# Altium schematic sheet xbowtie2.SchDoc
size A3; SheetNumber: 2; SheetTotal: 3
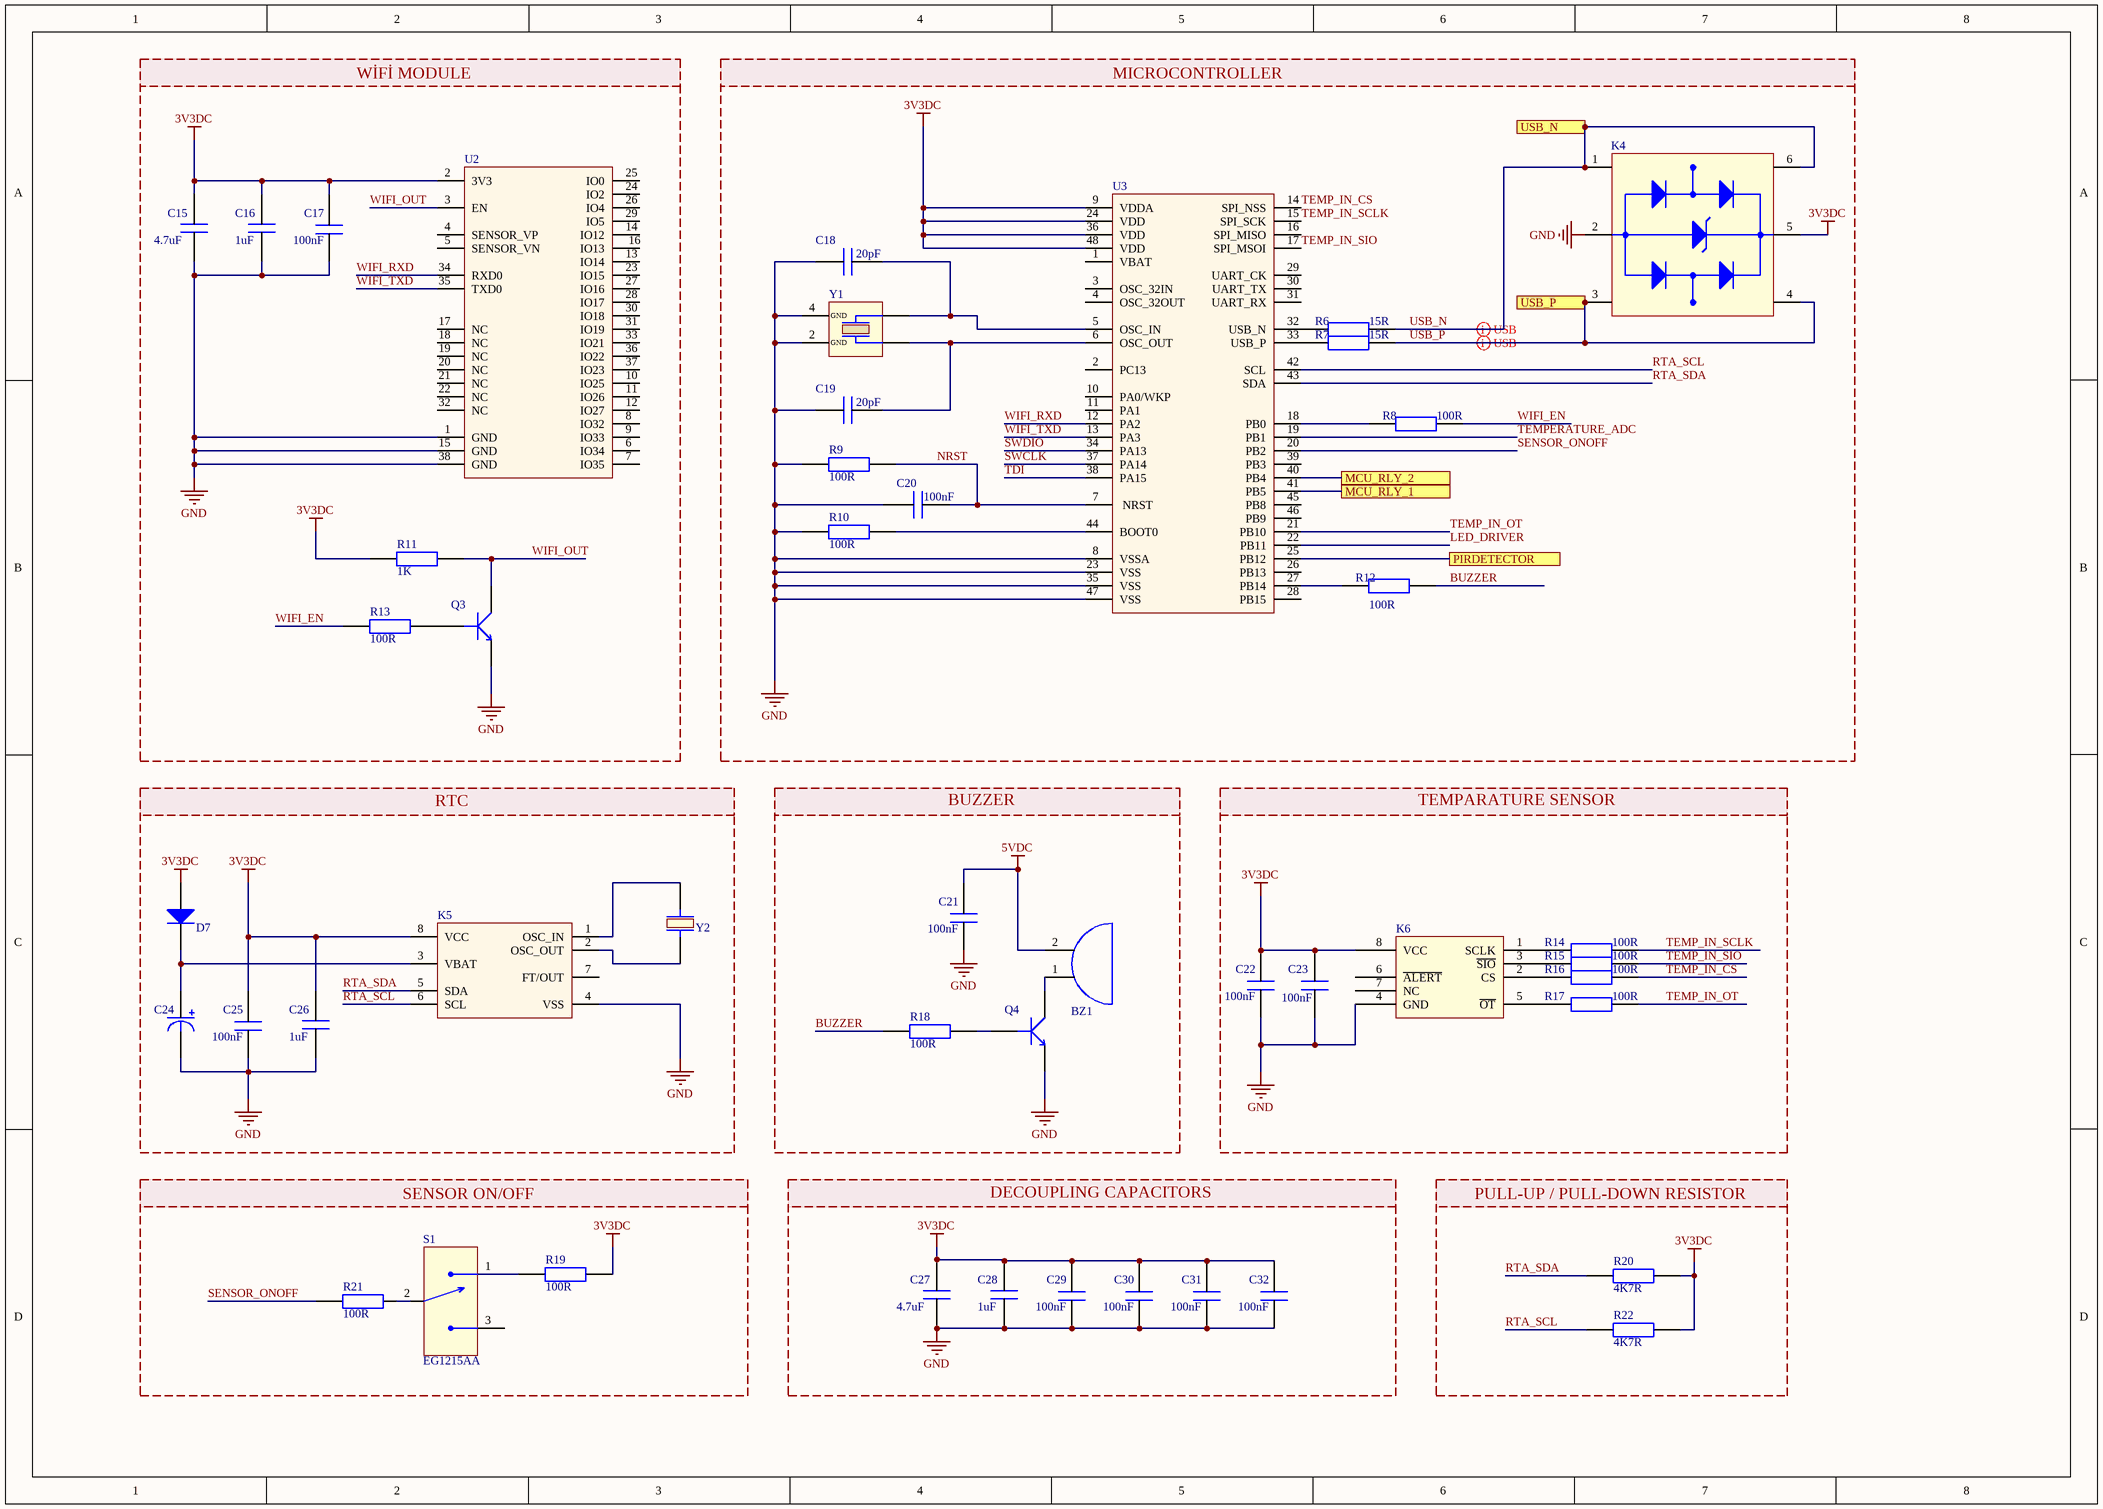
[diagram p0: xbowtie2.SchDoc]

## Parts
BZ1  CMI-9605IC-0580T  [CMI-9605IC]  (value not drawn)
C15  Capacitance: 4.7uF  [CAP_CER 0805]  (hidden comment: CAP CER 4.7uF 0805)
C16  1uF  [CAP_CER 0805]
C17  100nF  [CAP_CER 0805]
C18  20pF
C19  20pF
C20  100nF  [CAP_CER 0805]
C21  100nF  [CAP_CER 0805]
C22  100nF  [CAP_CER 0805]
C23  100nF  [CAP_CER 0805]
C24  ESH477M050AH4AA  [ESH477]  (value not drawn)
C25  100nF  [CAP_CER 0805]
C26  1uF  [CAP_CER 0805]
C27  Capacitance: 4.7uF  [CAP_CER 0805]  (hidden comment: CAP CER 4.7uF 0805)
C28  1uF  [CAP_CER 0805]
C29  100nF  [CAP_CER 0805]
C30  100nF  [CAP_CER 0805]
C31  100nF  [CAP_CER 0805]
C32  100nF  [CAP_CER 0805]
D7  1N4148WS  [1N4148WS]  (value not drawn)
K4  USBLC6-2SC6  [USBLC6-2SC6]  (value not drawn)
K5  M41T00M6F  [M41T00M6F]  (value not drawn)
K6  MAX6662  [MAKSİMUMA 6662MSA+]  (value not drawn)
Q3  MMBT3904-7-F  [MMBT3904-7-F]  (value not drawn)
Q4  MMBT3904-7-F  [MMBT3904-7-F]  (value not drawn)
R6  15R  [RES_0603]
R7  15R  [RES_0603]
R8  100R  [RES_0603]
R9  100R  [RES_0603]
R10  100R  [RES_0603]
R11  1K  [RES_0603]
R12  100R  [RES_0603]
R13  100R  [RES_0603]
R14  100R  [RES_0603]
R15  100R  [RES_0603]
R16  100R  [RES_0603]
R17  100R  [RES_0603]
R18  100R  [RES_0603]
R19  100R  [RES_0603]
R20  4K7R  [RES_0603]
R21  100R  [RES_0603]
R22  4K7R  [RES_0603]
S1  EG1215AA  [EG1215AA]
U2  ESP32-WROOM-32E (4MB)  [ESP32-32E]  (value not drawn)
U3  STM32F103C6T6A  [STM32]  (value not drawn)
Y1  CRYSTAL 16MHz  [ECS]  (value not drawn)
Y2  CRYSTAL 32.7680KHZ 12.5PF SMD  [ABS05]  (value not drawn)

## Ports
MCU_RLY_1, MCU_RLY_2, PIRDETECTOR, USB_N, USB_P

## Nets
3V3DC: C15.2 C16.2 C17.2 C22.2 C23.2 C25.2 C26.2 C27.2 C28.2 C29.2 C30.2 C31.2 C32.2 D7.2 K4.5(VBUS) K5.8(VCC) K6.8(VCC) R11.1 R19.2 R20.2 R22.2 U2.2(3V3) U3.9(VDDA) U3.24(VDD) U3.36(VDD) U3.48(VDD)
5VDC: BZ1.2 C21.2
GND: C15.1 C16.1 C17.1 C18.1 C19.1 C20.2 C21.1 C22.1 C23.1 C24.2 C25.1 C26.1 C27.1 C28.1 C29.1 C30.1 C31.1 C32.1 K4.2(GND) K5.4(VSS) K6.4(GND) Q3.2(E) Q4.2(E) R9.1 R10.1 U2.1(GND) U2.15(GND) U2.38(GND) U3.8(VSSA) U3.23(VSS) U3.35(VSS) U3.47(VSS) Y1.2(GND) Y1.4(GND)
BUZZER: R12.2 R18.1
LED_DRIVER: U3.22(PB11)
MCU_RLY_1: U3.41(PB5) ; port MCU_RLY_1
MCU_RLY_2: U3.40(PB4) ; port MCU_RLY_2
NRST: C20.1 R9.2 U3.7(NRST)
PIRDETECTOR: U3.25(PB12) ; port PIRDETECTOR
RTA_SCL: K5.6(SCL) R22.1 U3.42(SCL)
RTA_SDA: K5.5(SDA) R20.1 U3.43(SDA)
SENSOR_ONOFF: R21.1 U3.20(PB2)
SWCLK: U3.37(PA14)
SWDIO: U3.34(PA13)
TDI: U3.38(PA15)
TEMP_IN_CS: R16.2 U3.14(SPI_NSS)
TEMP_IN_OT: R17.2 U3.21(PB10)
TEMP_IN_SCLK: R14.2 U3.15(SPI_SCK)
TEMP_IN_SIO: R15.2 U3.17(SPI_MSOI)
TEMPERATURE_ADC: U3.19(PB1)
USB_N: K4.1(I/O1_IN) K4.6(I/O1_OUT) R6.2 ; port USB_N
USB_P: K4.3(I/O2_IN) K4.4(I/O2_OUT) R7.2 ; port USB_P
WIFI_EN: R8.2 R13.1
WIFI_OUT: Q3.C R11.2 U2.3(EN)
WIFI_RXD: U2.34(RXD0) U3.12(PA2)
WIFI_TXD: U2.35(TXD0) U3.13(PA3)
NetBZ1_1: BZ1.1 Q4.C
NetC18_2: C18.2 U3.5(OSC_IN) Y1.3
NetC19_2: C19.2 U3.6(OSC_OUT) Y1.1
NetC24_1: C24.1 D7.1 K5.3(VBAT)
NetK5_1: K5.1(OSC_IN) Y2.2
NetK5_2: K5.2(OSC_OUT) Y2.1
NetK6_1: K6.1(SCLK) R14.1
NetK6_2: K6.2(CS) R16.1
NetK6_3: K6.3(~{SIO}) R15.1
NetK6_5: K6.5(~{OT}) R17.1
NetQ3_1: Q3.1(B) R13.2
NetQ4_1: Q4.1(B) R18.2
NetR6_1: R6.1 U3.32(USB_N)
NetR7_1: R7.1 U3.33(USB_P)
NetR8_1: R8.1 U3.18(PB0)
NetR10_2: R10.2 U3.44(BOOT0)
NetR12_1: R12.1 U3.27(PB14)
NetR19_1: R19.1 S1.1
NetR21_2: R21.2 S1.2

Not connected (* = marked no-connect by the designer): K5 7(FT/OUT); K6 6(~{ALERT}) 7(NC); S1 3; U2 4(SENSOR_VP) 5(SENSOR_VN) 6(IO34) 7(IO35) 8(IO32) 9(IO33) 10(IO25) 11(IO26) 12(IO27) 13(IO14) 14(IO12) 17(NC) 18(NC) 19(NC) 20(NC) 21(NC) 22(NC) 23(IO15) 24(IO2) 25(IO0) 26(IO4) 27(IO16) 28(IO17) 29(IO5) 30(IO18) 31(IO19) 32(NC) 33(IO21) 36(IO22) 37(IO23)  16(IO13); U3 1(VBAT) 2(PC13) 3(OSC_32IN) 4(OSC_32OUT) 10(PA0/WKP) 11(PA1) 16(SPI_MISO) 26(PB13) 28(PB15) 29(UART_CK) 30(UART_TX) 31(UART_RX) 39(PB3) 45(PB8) 46(PB9)

## Layout directives
differential pair: USB_N, USB_P

## Notes on the sheet
- WİFİ MODULE
- MICROCONTROLLER
- RTC
- BUZZER
- TEMPARATURE SENSOR
- SENSOR ON/OFF
- DECOUPLING CAPACITORS
- PULL-UP / PULL-DOWN RESISTOR

## Library data of the parts
BZ1 = CMI-9605IC-0580T: Audio Buzzer Magnetic 3VDC 7VDC 30mA 5VDC 85dB 2600Hz to 2800Hz Through Hole Pin Box; Manufacturer: CUI Devices; Shape: 4456Shape; Supplier 1: Digikey; Manufacturer Part Number: CMI-9605IC-0580T; RoHS: No; Category: Audio Products; Stock 1: 5449; Pricing 1: 1=1,22, 10=1,014, 25=0,938, 50=0,883, 100=0,8298, 250=0,76976, 500=0,71396, 1000=0,66741, 5000=0,65403 (USD); Length: 9.6mm; Width: 9.6mm; Height: 5mm; Supplier Part Number 1: 2223-CMI-9605IC-0580T-ND
C15 C27 = CAP CER 4.7uF 0805: Manufacturer: Samsung; Manufacturer Part Number: CL21A475KBQNNNE; Material: 4241ConductorMaterial; Tolerance: 10%; Voltage Rating: 50V; Dielectric: X5R; Supplier 1: Digikey; RoHS: Yes; Category: Ceramic Capacitors; Stock 1: 277343; Pricing 1: 1=0,23, 10=0,148, 50=0,104, 100=0,084, 500=0,06244, 1000=0,05464 (USD); Mount: Surface Mount; Case/Package: 0805; Case Code (Metric): 2012; Case Code (Imperial): 0805; Min Operating Temperature: -55°C; Max Operating Temperature: 85°C; Packaging: Tape and Reel; Series: CL; Voltage Rating (DC): 50V; Package Quantity: 1; Length: 2mm; Width: 0.049inch; Thickness: 0.055inch; Depth: 1.25mm; Radiation Hardening: No; RoHS Compliant: Yes; ComponentLink1URL: https://datasheet.ciiva.com/25797/cl21a475kbqnnne-25797730.pdf?src-supplier=Digikey; ComponentLink1Description: https://datasheet.ciiva.com/25797/cl21a475kbqnnne-25797730.pdf?src-supplier=Digikey; ComponentLink2URL: https://datasheet.ciiva.com/16428/cl21a475kbqnnne-16428877.pdf?src-supplier=Future+Electronics; ComponentLink2Description: https://datasheet.ciiva.com/16428/cl21a475kbqnnne-16428877.pdf?src-supplier=Future+Electronics; ComponentLink3URL: https://datasheet.ciiva.com/26838/getdatasheetpartid-470982-26838620.pdf?src-supplier=Verical; ComponentLink3Description: https://datasheet.ciiva.com/26838/getdatasheetpartid-470982-26838620.pdf?src-supplier=Verical; Supplier Part Number 1: 1276-1248-1-ND
C16 C26 C28 = CAP CER 1uF 0805: CAP CER 1uF %10 0805; Manufacturer: Samsung; Manufacturer Part Number: CL21B105KBFNNNE; Material: Ceramic; Tolerance: 10%; Voltage Rating: 50V; Dielectric: X7R; Supplier 1: Digikey; RoHS: Yes; Category: Ceramic Capacitors; Stock 1: 1550845; Pricing 1: 1=0,11, 10=0,075, 50=0,045, 100=0,0354, 500=0,02616, 1000=0,02165 (USD); Mount: Surface Mount; Case/Package: 0805; Case Code (Metric): 2012; Case Code (Imperial): 0805; Min Operating Temperature: -55°C; Max Operating Temperature: 125°C; Packaging: Tape and Reel; Package Quantity: 1; Voltage: 50V; Series: CL; Construction: Flat; Voltage Rating (DC): 50V; Length: 2mm; Width: 0.049inch; Height: 1.25mm; Thickness: 0.053inch; Depth: 1.25mm; Radiation Hardening: No; RoHS Compliant: Yes; ComponentLink1URL: https://datasheet.ciiva.com/25800/cl21b105kbfnnne-25800291.pdf?src-supplier=Digikey; ComponentLink1Description: https://datasheet.ciiva.com/25800/cl21b105kbfnnne-25800291.pdf?src-supplier=Digikey; Supplier Part Number 1: 1276-1029-1-ND; Capacitance: 1uF
C17 C20-C23 C25 C29-C32 = CAP CER 100nF 0805
C18 C19 = CAP CER 20 pF 0603
C24 = CAP ALU ELEC 470 uF 50V: Cap, 470UF, 50V, Alu Elec, Radial; Manufacturer: KEMET; Supplier 1: Digikey; Manufacturer Part Number: ESH477M050AH4AA; RoHS: Yes; Stock 1: 12377; Pricing 1: 1=0,64, 10=0,432, 200=0,28415, 1000=0,1887, 5000=0,1665, 10000=0,1554 (USD); ComponentLink1URL: https://api.kemet.com/component-edge/download/datasheet/ESH477M050AH4AA.pdf?src-supplier=Digikey; ComponentLink1Description: https://api.kemet.com/component-edge/download/datasheet/ESH477M050AH4AA.pdf?src-supplier=Digikey; ComponentLink2URL: https://datasheet.octopart.com/ESH477M050AH4AA-KEMET-datasheet-130075338.pdf?src-supplier=Newark; ComponentLink2Description: https://datasheet.octopart.com/ESH477M050AH4AA-KEMET-datasheet-130075338.pdf?src-supplier=Newark; Supplier Part Number 1: 399-15683-ND
D7 = 1N4148WS: Diode Ultra Fast Recovery Rectifier 75V 0.15A 2-Pin SOD-323F T/R; Manufacturer: ON Semiconductor / Fairchild; Max Reverse Current: 5uA; Average Rectified Current: 150mA; Reverse Recovery Time: 4ns; Max Forward Surge Current (Ifsm): 2A; Capacitance: 4pF; Element Configuration: Single; Supplier 1: Digikey; Manufacturer Part Number: 1N4148WS; RoHS: Yes; Category: Rectifier Diodes; Stock 1: 807861; Pricing 1: 1=0,19, 10=0,136, 100=0,0733, 500=0,0576, 1000=0,04 (USD); Mount: Surface Mount; Number of Pins: 2; Weight: 0.0276g; Min Operating Temperature: -55°C; Max Operating Temperature: 150°C; Max Reverse Voltage (DC): 75V; Series: -; Packaging: Tape and Reel; Forward Current: 150mA; Package Quantity: 1; Recovery Time: 4ns; Max Repetitive Reverse Voltage (Vrrm): 75V; Reverse Voltage: 75V; Length: 1.8mm; Width: 1.35mm; Height: 1mm; Radiation Hardening: No; RoHS Compliant: Yes; Reach SVHC Compliant: No; Lead Free: Lead Free; ComponentLink1URL: https://datasheet.ciiva.com/15208/getdatasheetpartid-127819-15208358.pdf?src-supplier=Verical; ComponentLink1Description: https://datasheet.ciiva.com/15208/getdatasheetpartid-127819-15208358.pdf?src-supplier=Verical; ComponentLink2URL: https://datasheet.ciiva.com/8300/1n914bws-8300360.pdf?src-supplier=Avnet; ComponentLink2Description: https://datasheet.ciiva.com/8300/1n914bws-8300360.pdf?src-supplier=Avnet; ComponentLink3URL: https://datasheet.ciiva.com/910/1n4148ws-910381.pdf?src-supplier=Digikey; ComponentLink3Description: https://datasheet.ciiva.com/910/1n4148ws-910381.pdf?src-supplier=Digikey; Supplier Part Number 1: 1N4148WSFSCT-ND
K5 = M41T00M6F: Real-time Clocks Clock/Calendar I2C, 2-Wire Serial 70uA @ 2V ~ 5.5V SOIC-8_150mil RoHS; Manufacturer: STMicroelectronics; Supplier 1: Digikey; Manufacturer Part Number: M41T00M6F; RoHS: Yes; Category: Real Time Clocks; Stock 1: 6434; Pricing 1: 1=3,77, 10=3,388, 25=3,2032, 100=2,776, 250=2,63364, 500=2,36316, 1000=1,99303 (USD); ComponentLink1URL: https://datasheet.ciiva.com/7630/1837112-7630077.pdf?src-supplier=Element14; ComponentLink1Description: https://datasheet.ciiva.com/7630/1837112-7630077.pdf?src-supplier=Element14; ComponentLink2URL: https://datasheet.ciiva.com/16213/cd00001542-16213654.pdf?src-supplier=Future+Electronics; ComponentLink2Description: https://datasheet.ciiva.com/16213/cd00001542-16213654.pdf?src-supplier=Future+Electronics; ComponentLink3URL: https://datasheet.ciiva.com/41459/001185345-da-01-en-ic-rtc-srl-512kbit-m41t00m6f-soic-8-stm-41459818.pdf?src-supplier=Conrad; ComponentLink3Description: https://datasheet.ciiva.com/41459/001185345-da-01-en-ic-rtc-srl-512kbit-m41t00m6f-soic-8-stm-41459818.pdf?src-supplier=Conrad; Supplier Part Number 1: 497-4697-1-ND
K6 = MAX6662: Temp Sensor Digital Serial (3-Wire, SPI) 8-Pin SOIC N Tube; Manufacturer: Maxim; Manufacturer Part Number: MAX6662MSA+; Supplier 1: Digikey; RoHS: Yes; Category: Temperature and Humidity Sensors; Stock 1: 718; Pricing 1: 1=4,61, 10=3,454, 25=3,0704, 50=2,9168, 100=2,8401, 500=2,37956, 1000=2,22604 (USD); ComponentLink1URL: https://datasheet.ciiva.com/5299/max6662-89142-5299456.pdf?src-supplier=Mouser; ComponentLink1Description: https://datasheet.ciiva.com/5299/max6662-89142-5299456.pdf?src-supplier=Mouser; ComponentLink2URL: https://datasheet.ciiva.com/3277/max6662-3277979.pdf?src-supplier=Avnet; ComponentLink2Description: https://datasheet.ciiva.com/3277/max6662-3277979.pdf?src-supplier=Avnet; ComponentLink3URL: https://datasheet.ciiva.com/2003/max6662-2003390.pdf?src-supplier=Digikey; ComponentLink3Description: https://datasheet.ciiva.com/2003/max6662-2003390.pdf?src-supplier=Digikey; Supplier Part Number 1: MAX6662MSA+-ND
Q3 Q4 = MMBT3904-7-F: Transistor General Purpose BJT NPN 40 Volt 0.2A Automotive 3-Pin SOT-23; Manufacturer: Diodes Zetex; Max Power Dissipation: 300mW; Collector Emitter Voltage (VCEO): 40V; Max Collector Current: 200mA; Collector Base Voltage (VCBO): 60V; Power Dissipation: 350mW; Frequency: 300MHz; hFE Min: 100; Number of Elements: 1; Emitter Base Voltage (VEBO): 6V; Collector Emitter Saturation Voltage: 300mV; Supplier 1: Digikey; Manufacturer Part Number: MMBT3904-7-F; RoHS: Yes; Category: BJTs; Stock 1: 5031738; Pricing 1: 1=0,12, 10=0,086, 100=0,0467, 500=0,03666, 1000=0,02545 (USD); Mount: Surface Mount; Case/Package: SOT-23; Number of Pins: 3; Weight: 0.000282oz; Min Operating Temperature: -55°C; Max Operating Temperature: 150°C; Polarity: NPN; Packaging: Tape and Reel; Voltage Rating (DC): 40V; Package Quantity: 3000; Transition Frequency: 300MHz; Collector Emitter Breakdown Voltage: 40V; Max Breakdown Voltage: 40V; Continuous Collector Current: 200mA; Max Frequency: 300MHz; Gain Bandwidth Product: 300MHz; Series: Automotive, AEC-Q101; Collector-emitter Voltage-Max: 300mV; Length: 3.05mm; Width: 1.4mm; Height: 1mm; Radiation Hardening: No; Reach SVHC Compliant: No; Lead Free: Lead Free; RoHS Compliant: Yes; ComponentLink1URL: https://datasheet.ciiva.com/11201/ds30036-11201778.pdf?src-supplier=Avnet; ComponentLink1Description: https://datasheet.ciiva.com/11201/ds30036-11201778.pdf?src-supplier=Avnet; ComponentLink2URL: https://datasheet.ciiva.com/15138/getdatasheetpartid-53265-15138780.pdf?src-supplier=Verical; ComponentLink2Description: https://datasheet.ciiva.com/15138/getdatasheetpartid-53265-15138780.pdf?src-supplier=Verical; ComponentLink3URL: https://datasheet.ciiva.com/22711/1915516-22711750.pdf?src-supplier=Element14; ComponentLink3Description: https://datasheet.ciiva.com/22711/1915516-22711750.pdf?src-supplier=Element14; ComponentLink4URL: https://datasheet.ciiva.com/11198/ds30036-11198999.pdf?src-supplier=Avnet; ComponentLink4Description: https://datasheet.ciiva.com/11198/ds30036-11198999.pdf?src-supplier=Avnet; ComponentLink5URL: https://datasheet.ciiva.com/6361/ds30036-6361256.pdf?src-supplier=Digikey; ComponentLink5Description: https://datasheet.ciiva.com/6361/ds30036-6361256.pdf?src-supplier=Digikey; ComponentLink6URL: https://datasheet.ciiva.com/6361/ds30036-6361254.pdf?src-supplier=Digikey; ComponentLink6Description: https://datasheet.ciiva.com/6361/ds30036-6361254.pdf?src-supplier=Digikey; Supplier Part Number 1: MMBT3904-FDICT-ND
R6 R7 = RES 15 OHM 0603
R8-R10 R12-R19 R21 = RES 100 OHM 0603
R11 = RES 1K OHM 0603
R20 R22 = RES 4K7 OHM 0603
S1 = EG1215AA: Slide Switch, SPDT, 0.025A, 24V, SMD; Manufacturer: E-Switch; Mechanical Life: 10000Cycles; Switch Function: On-On; Actuator Type: Standard; Switch Travel: 1.5mm; Operating Force: 150gf; Actuator Length: 1.4mm; Supplier 1: Digikey; Manufacturer Part Number: EG1215AA; RoHS: Yes; Stock 1: 14311; Pricing 1: 1=0,99, 10=0,951, 25=0,8884, 100=0,7715, 250=0,702, 500=0,6508, 1000=0,60327 (USD); Mount: Surface Mount; Min Operating Temperature: -20°C; Max Operating Temperature: 70°C; Throw Configuration: SPDT; Packaging: Cut Tape; Voltage Rating (DC): 24V; Termination: Gull Wing; Electrical Life: 10000Cycles; Series: EG; RoHS Compliant: Yes; ComponentLink1URL: https://media.digikey.com/pdf/Data%20Sheets/E-Switch%20PDFs/EG1215_Series_Ds.pdf?src-supplier=Digikey; ComponentLink1Description: https://media.digikey.com/pdf/Data%20Sheets/E-Switch%20PDFs/EG1215_Series_Ds.pdf?src-supplier=Digikey; ComponentLink2URL: http://www.farnell.com/datasheets/2645007.pdf?src-supplier=Farnell; ComponentLink2Description: http://www.farnell.com/datasheets/2645007.pdf?src-supplier=Farnell; Supplier Part Number 1: EG5720CT-ND
U3 = STM32F103C6T6A: MCU 32-bit STM32F ARM Cortex M3 RISC 32KB Flash 2.5V/3.3V 48-Pin LQFP Tray; Manufacturer: STMicroelectronics; Number of Timers/Counters: 3; Max Supply Voltage: 3.6V; Interface: I2C,SPI,USART; RAM Size: 10KB; Number of I/Os: 37; Min Supply Voltage: 2V; Data Bus Width: 32b; Max Frequency: 72MHz; Number of ADC Channels: 10; Supplier 1: Digikey; Manufacturer Part Number: STM32F103C6T6A; RoHS: Yes; Category: Microcontrollers; Stock 1: 1596; Pricing 1: 1=6,07, 10=5,453, 25=5,1552, 80=4,46775, 250=4,23868, 500=3,80336, 1000=3,20766, 2500=3,04728 (USD); Case/Package: LQFP; Number of Pins: 48; Weight: 0.006409oz; Min Operating Temperature: -40°C; Max Operating Temperature: 85°C; Packaging: Tray; Series: STM32F103C6; Package Quantity: 1500; Memory Type: FLASH; Memory Size: 32KB; Core Architecture: ARM; Length: 7mm; Width: 7mm; Height: 1.4mm; Lead Free: Lead Free; RoHS Compliant: Yes; ComponentLink1URL: https://datasheet.ciiva.com/15122/getdatasheetpartid-69879-15122075.pdf?src-supplier=Verical; ComponentLink1Description: https://datasheet.ciiva.com/15122/getdatasheetpartid-69879-15122075.pdf?src-supplier=Verical; ComponentLink2URL: https://datasheet.ciiva.com/14100/pustm-arm-microcont-stm32f103-en-14100507.pdf?src-supplier=Distrelec; ComponentLink2Description: https://datasheet.ciiva.com/14100/pustm-arm-microcont-stm32f103-en-14100507.pdf?src-supplier=Distrelec; Supplier Part Number 1: 497-11515-ND
Y2 = CRYSTAL 32768kHz: CRYSTAL 32.768kHz ±20ppm Crystal 12.5pF 90 kOhm -40°C ^ 85°C Surface Mount 2-SMD; Manufacturer: Abracon; Manufacturer Part Number: ABS05-32.768KHZ-T; ESR (Equivalent Series Resistance): 90kR; Supplier 1: Digikey; RoHS: Yes; Category: Crystals; Stock 1: 140496; Pricing 1: 1=0,75, 10=0,628, 50=0,565, 100=0,5022, 500=0,4771, 1000=0,40177 (USD); Mount: Surface Mount; Case/Package: CSMD; Number of Pins: 2; Min Operating Temperature: -40°C; Max Operating Temperature: 85°C; Packaging: Tape and Reel; Frequency Tolerance: 20ppm; Load Capacitance: 12.5pF; Package Quantity: 3000; Tolerance: 20ppm; Termination: SMD/SMT; Series Resistance: 90kR; Series: ABS05; Operating Frequency: 32.768 kHz; Length: 1.6mm; Width: 1mm; Height: 0.5mm; Depth: 1mm; Radiation Hardening: No; Reach SVHC Compliant: No; Lead Free: Lead Free; RoHS Compliant: Yes; ComponentLink1URL: https://datasheet.ciiva.com/23810/abs05-23810480.pdf?src-supplier=Newark; ComponentLink1Description: https://datasheet.ciiva.com/23810/abs05-23810480.pdf?src-supplier=Newark; ComponentLink2URL: https://datasheet.ciiva.com/6728/abs05-6728949.pdf?src-supplier=Digikey; ComponentLink2Description: https://datasheet.ciiva.com/6728/abs05-6728949.pdf?src-supplier=Digikey; ComponentLink3URL: https://datasheet.ciiva.com/6728/abs05-6728950.pdf?src-supplier=Digikey; ComponentLink3Description: https://datasheet.ciiva.com/6728/abs05-6728950.pdf?src-supplier=Digikey; ComponentLink4URL: https://datasheet.ciiva.com/16411/abs05-16411149.pdf?src-supplier=Future+Electronics; ComponentLink4Description: https://datasheet.ciiva.com/16411/abs05-16411149.pdf?src-supplier=Future+Electronics; Supplier Part Number 1: 535-11899-1-ND; Frequency: 32.768kHz